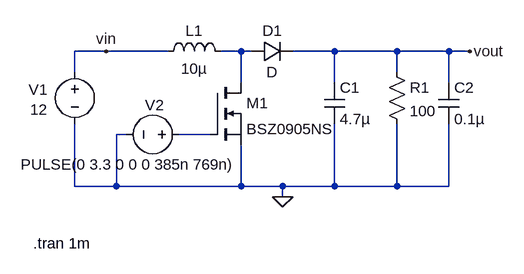
[diagram p0: schematic boost_converter.asc]
boost_converter.asc, the LTspice schematic file:
Version 4
SHEET 1 928 680
WIRE -16 144 -64 144
WIRE 80 144 -16 144
WIRE 192 144 160 144
WIRE 208 144 192 144
WIRE 336 144 272 144
WIRE 432 144 336 144
WIRE 512 144 432 144
WIRE 544 144 512 144
WIRE -64 176 -64 144
WIRE 432 176 432 144
WIRE 192 192 192 144
WIRE 336 192 336 144
WIRE 512 192 512 144
WIRE 16 272 0 272
WIRE 144 272 96 272
WIRE -64 352 -64 256
WIRE 0 352 0 272
WIRE 0 352 -64 352
WIRE 192 352 192 288
WIRE 192 352 0 352
WIRE 256 352 192 352
WIRE 336 352 336 256
WIRE 336 352 256 352
WIRE 432 352 432 256
WIRE 432 352 336 352
WIRE 512 352 512 256
WIRE 512 352 432 352
WIRE 256 368 256 352
FLAG 256 368 0
FLAG -16 144 vin
FLAG 544 144 vout
SYMBOL ind 64 160 R270
WINDOW 0 32 56 VTop 2
WINDOW 3 5 56 VBottom 2
SYMATTR InstName L1
SYMATTR Value 10µ
SYMATTR SpiceLine Rser=1
SYMBOL cap 320 192 R0
SYMATTR InstName C1
SYMATTR Value 4.7µ
SYMBOL voltage -64 160 R0
WINDOW 123 0 0 Left 2
WINDOW 39 0 0 Left 2
WINDOW 0 -71 43 Left 2
WINDOW 3 -69 74 Left 2
SYMATTR InstName V1
SYMATTR Value 12
SYMBOL voltage 112 272 R90
WINDOW 0 -61 53 VTop 2
WINDOW 3 62 94 VBottom 2
WINDOW 123 0 0 Left 2
WINDOW 39 0 0 Left 2
SYMATTR InstName V2
SYMATTR Value PULSE(0 3.3 0 0 0 385n 769n)
SYMBOL res 416 160 R0
SYMATTR InstName R1
SYMATTR Value 100
SYMBOL cap 496 192 R0
SYMATTR InstName C2
SYMATTR Value 0.1µ
SYMBOL nmos 144 192 R0
SYMATTR InstName M1
SYMATTR Value BSZ0905NS
SYMBOL diode 208 160 R270
WINDOW 0 32 32 VTop 2
WINDOW 3 0 32 VBottom 2
SYMATTR InstName D1
TEXT -128 440 Left 2 !.tran 1m

The netlist it stands for:
* boost_converter.asc
L1 vin N001 10µ Rser=1
C1 vout 0 4.7µ
V1 vin 0 12
V2 N002 0 PULSE(0 3.3 0 0 0 385n 769n)
R1 vout 0 100
C2 vout 0 0.1µ
M1 N001 N002 0 0 BSZ0905NS
D1 N001 vout D
.model D D
.lib standard.dio
.model NMOS NMOS
.model PMOS PMOS
.lib standard.mos
.tran 1m
.backanno
.end